# Altium schematic sheet ELEC-DEM-555Timer.SchDoc
size A4
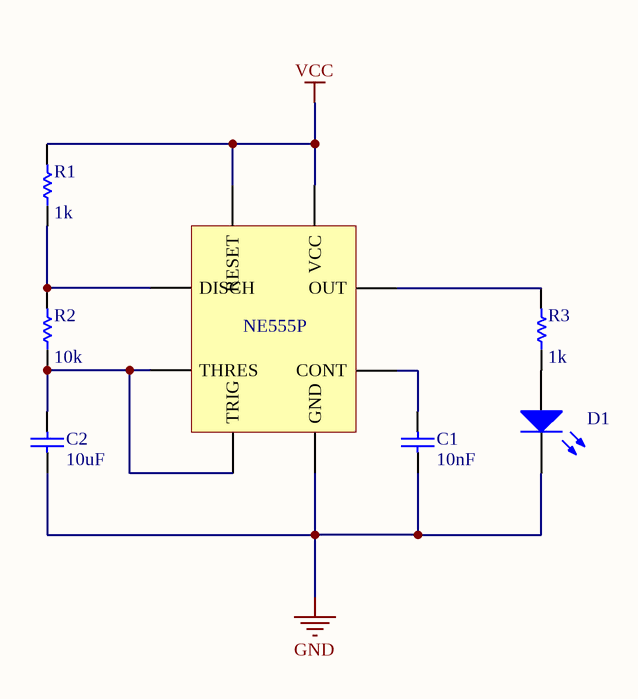
[diagram p0: ELEC-DEM-555Timer.SchDoc]

## Parts
C1  10nF  [RAD-0.3]
C2  10uF  [RAD-0.3]
D1  LED1  [LED-1]  (value not drawn)
NE555P  NE555P
R1  value 1k  [AXIAL-0.5]  (hidden comment: Res Semi)
R2  value 10k  [AXIAL-0.5]  (hidden comment: Res Semi_1)
R3  value 1k  [AXIAL-0.5]  (hidden comment: Res Semi)

## Nets
GND: C1.1 C2.1 D1.2(K) NE555P.2(GND)
VCC: NE555P.2(RESET) R1.2
NetC1_2: C1.2 NE555P.2(CONT)
NetC2_2: C2.2 NE555P.2(THRES) R2.1
NetD1_1: D1.1(A) R3.1
NetNE555P_2: NE555P.2(OUT) R3.2
NetNE555P_2: NE555P.2(DISCH) R1.1 R2.2  [a separate net that carries the same name]

## Library data of the parts
C1 = 10nF: Capacitor; Published: 8-Jun-2000; LatestRevisionDate: 17-Jul-2002; LatestRevisionNote: Re-released for DXP Platform.; PackageReference: RAD-0.3; Publisher: Altium Limited; PackageDescription: Radial Cap, Thru-Hole; 2 Leads; 0.3 in Pin Spacing; Supplier 1: Digi-Key; Value: 10nF; Supplier Part Number 1: 1276-1051-1-ND
C2 = 10uF: Capacitor; Published: 8-Jun-2000; LatestRevisionDate: 17-Jul-2002; LatestRevisionNote: Re-released for DXP Platform.; PackageReference: RAD-0.3; Publisher: Altium Limited; PackageDescription: Radial Cap, Thru-Hole; 2 Leads; 0.3 in Pin Spacing; Supplier 1: Digi-Key; Value: 10uF; Supplier Part Number 1: 478-1653-6-ND
D1 = LED1: Typical RED GaAs LED; Published: 8-Jun-2000; LatestRevisionDate: 08-Jul-2005; LatestRevisionNote: Mech Layer 1 removed.; PackageReference: LED-1; Publisher: Altium Limited; PackageDescription: LED; 2 Leads; Supplier 1: Digi-Key; Supplier Part Number 1: SML-D12U1WT86CT-ND
R1 R3 = Res Semi: 1k Resistor; Published: 8-Jun-2000; LatestRevisionDate: 17-Jul-2002; LatestRevisionNote: Re-released for DXP Platform.; PackageReference: AXIAL-0.5; Publisher: Altium Limited; PackageDescription: Axial Device, Thru-Hole; 2 Leads; 0.5 in Pin Spacing; Supplier 1: Digi-Key; Supplier Part Number 1: RNF14FTD1K00CT-ND
R2 = Res Semi_1: 10k Resistor; Published: 8-Jun-2000; LatestRevisionDate: 17-Jul-2002; LatestRevisionNote: Re-released for DXP Platform.; PackageReference: AXIAL-0.5; Publisher: Altium Limited; PackageDescription: Axial Device, Thru-Hole; 2 Leads; 0.5 in Pin Spacing; Supplier 1: Digi-Key; Supplier Part Number 1: 10.0KXTR-ND
NE555P = NE555P: Supplier 1: Digi-Key; Supplier Part Number 1: 296-1411-5-ND